# Altium schematic sheet Power Supply.SchDoc
size A4
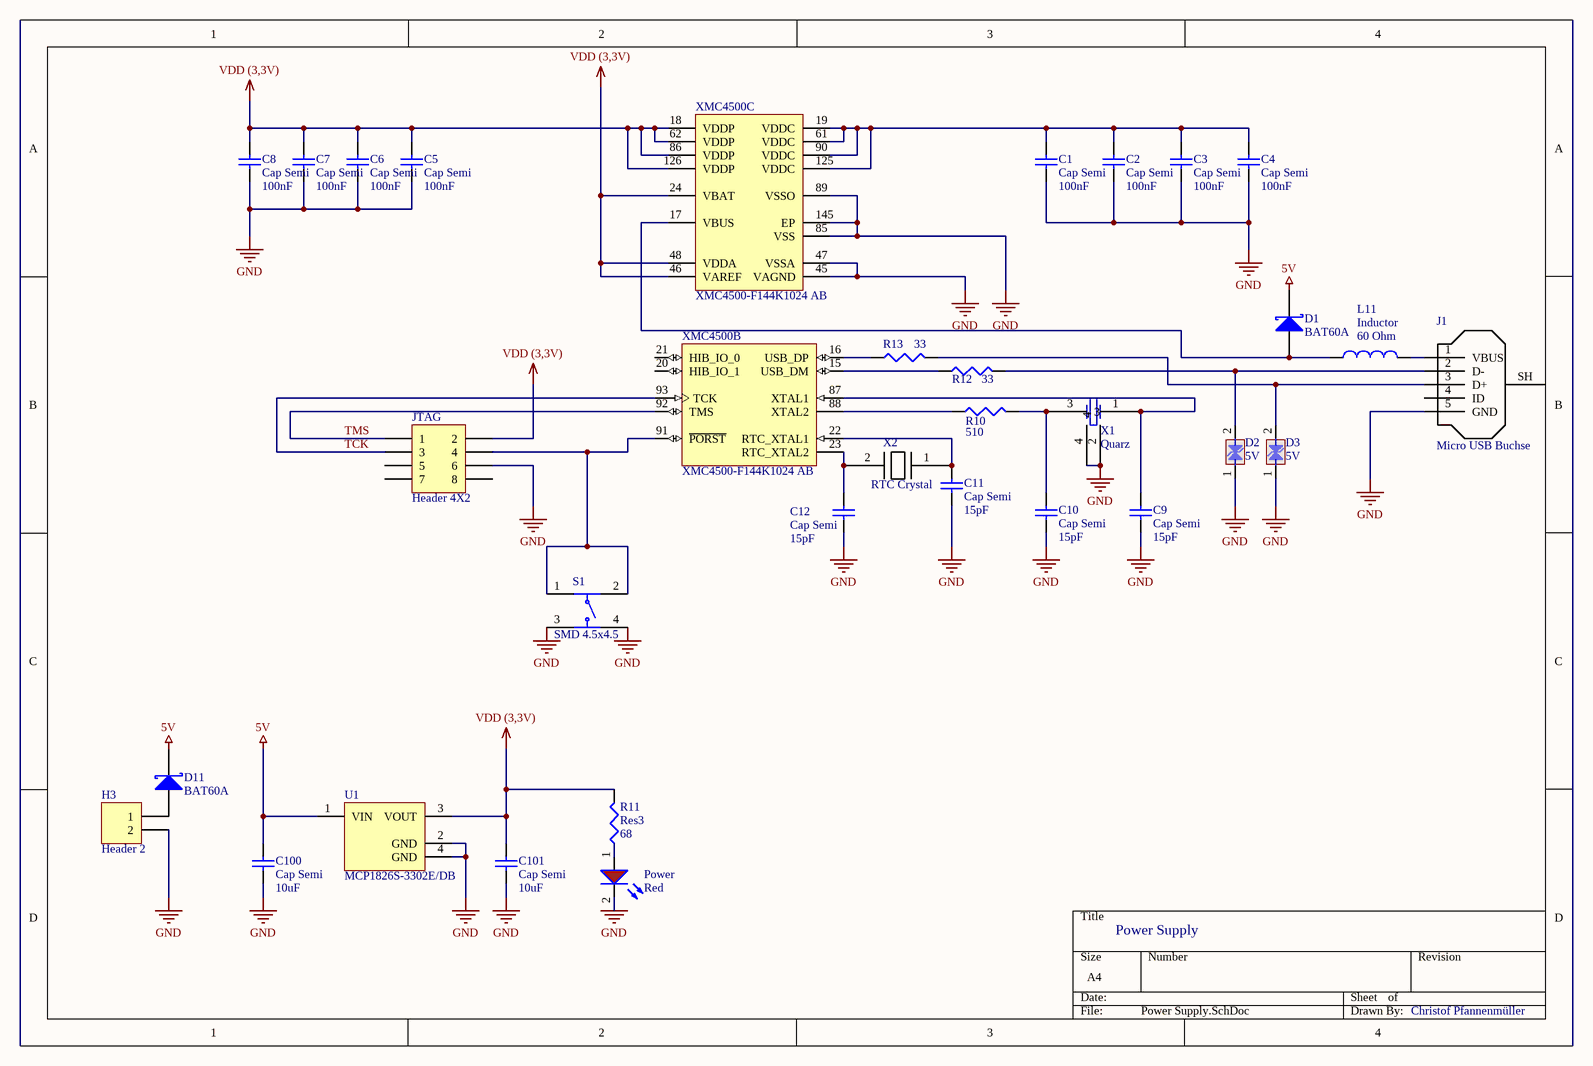
[diagram p0: Power Supply.SchDoc]

## Parts
C1  Cap Semi  value 100nF  [0402]
C2  Cap Semi  value 100nF  [0402]
C3  Cap Semi  value 100nF  [0402]
C4  Cap Semi  value 100nF  [0402]
C5  Cap Semi  value 100nF  [0402]
C6  Cap Semi  value 100nF  [0402]
C7  Cap Semi  value 100nF  [0402]
C8  Cap Semi  value 100nF  [0402]
C9  Cap Semi  value 15pF  [0402]
C10  Cap Semi  value 15pF  [0402]
C11  Cap Semi  value 15pF  [0402]
C12  Cap Semi  value 15pF  [0402]
C100  Cap Semi  value 10uF  [C1206]
C101  Cap Semi  value 10uF  [C1206]
D1  BAT60A  [SOD-323]
D2  5V  [WE-VE_0603]
D3  5V  [WE-VE_0603]
D11  BAT60A  [SOD-323]
H3  Header 2  [HDR1X2]
J1  Micro USB Buchse  [Micro USB Buchse - Molex]
JTAG  Header 4X2  [HDR2X4]
L11  Inductor  value 60 Ohm  [0603]
Power  Red  [LED_0805_Red]
R10  value 510  [J1-0603]  (hidden comment: Res3)
R11  Res3  value 68  [J1-0603]
R12  value 33  [J1-0603]  (hidden comment: Res3)
R13  value 33  [J1-0603]  (hidden comment: Res3)
S1  SMD 4.5x4.5  [430181038816]
U1  MCP1826S-3302E/DB  [SOT-223-DB3_N]
X1  Quarz  [Quarz]
X2  RTC Crystal  [RTC Uhrenquarz  1.5x3.2 SMD]
XMC4500  XMC4500-F144K1024 AB  [INF-PG-LQFP-144-18-6500X6500TP_N]  (parts B,C of 3)

## Nets
5V: C100.2 D1.1(K) D11.1(K) U1.1(VIN)
GND: C1.1 C2.1 C3.1 C4.1 C5.1 C6.1 C7.1 C8.1 C9.1 C10.1 C11.1 C12.1 C100.1 C101.1 D2.1(I/O1) D3.1(I/O1) H3.2 J1.5(GND) JTAG.6 Power.2(C) S1.3 S1.4 U1.2(GND) U1.4(GND) X1.2 X1.4 XMC4500.45(VAGND) XMC4500.47(VSSA) XMC4500.85(VSS) XMC4500.89(VSSO) XMC4500.145(EP)
VDD (3,3V): C5.2 C6.2 C7.2 C8.2 C101.2 JTAG.2 R11.2 U1.3(VOUT) XMC4500.18(VDDP) XMC4500.24(VBAT) XMC4500.46(VAREF) XMC4500.48(VDDA) XMC4500.62(VDDP) XMC4500.86(VDDP) XMC4500.126(VDDP)
TCK: JTAG.3 XMC4500.93(TCK)
TMS: JTAG.1 XMC4500.92(TMS)
NetC1_2: C1.2 C2.2 C3.2 C4.2 XMC4500.19(VDDC) XMC4500.61(VDDC) XMC4500.90(VDDC) XMC4500.125(VDDC)
NetC9_2: C9.2 X1.1 XMC4500.87(XTAL1)
NetC10_2: C10.2 R10.2 X1.3
NetC11_2: C11.2 X2.1 XMC4500.22(RTC_XTAL1)
NetC12_2: C12.2 X2.2 XMC4500.23(RTC_XTAL2)
NetD1_2: D1.2(A) L11.1 XMC4500.17(VBUS)
NetD2_2: D2.2(I/O2) J1.2(D-) R12.2
NetD3_2: D3.2(I/O2) J1.3(D+) R13.2
NetD11_2: D11.2(A) H3.1
NetJ1_1: J1.1(VBUS) L11.2
NetJTAG_4: JTAG.4 S1.1 S1.2 XMC4500.91(~{PORST})
NetPower_1: Power.1(A) R11.1
NetR10_1: R10.1 XMC4500.88(XTAL2)
NetR12_1: R12.1 XMC4500.15(USB_DM)
NetR13_1: R13.1 XMC4500.16(USB_DP)

Not connected (* = marked no-connect by the designer): J1 4(ID) SH; JTAG 5 7 8; XMC4500 20(HIB_IO_1) 21(HIB_IO_0)

## Notes on the sheet
- Power Supply
- Christof Pfannenmüller

## Library data of the parts
C1-C12 C100 C101 = Cap Semi: Capacitor (Semiconductor SIM Model); Published: 8-Jun-2000; LatestRevisionDate: 29-May-2009; LatestRevisionNote: IPC-7351 Footprint Added.; Publisher: Altium Limited; PackageDescription: Chip Capacitor
  C1-C12: PackageReference: C0402
  C100 C101: PackageReference: C1206
D1 D11 = BAT60A: Silicon AF Schottky Rectifier Diode with Extreme Low VF Drop; Published: 21-Mar-2003; LatestRevisionDate: 19-Mar-2004; LatestRevisionNote: Silkscreen size reduced.; DatasheetDocument: Jan-1999; PackageDocument: Sep-2000; PackageReference: SOD-323; Publisher: Altium Limited; ComponentLink1Description: Manufacturer Link; ComponentLink1URL: http://www.infineon.com/; ComponentLink2Description: Datasheet; ComponentLink2URL: http://www.infineon.com/upload/Document/cmc_upload/documents/081/715/bat60aseries_1.pdf
D2 D3 = WE-VE 0603, 82356050560: WE-VE ESD Suppressor, 0603, VDC=5V; Manufacturer: Wurth Elektronik; VDC: 5V; PartNo: 82356050560; ComponentLink1Description: Manufacturer; ComponentLink1URL: http://www.we-online.de; Created by: BJ.Chen; Created Date: Jan 2016; ComponentLink2Description: Datasheet; ComponentLink2URL: http://katalog.we-online.de/pbs/datasheet/82356050560.pdf
H3 = Header 2: Header, 2-Pin; LatestRevisionDate: 17-Jul-2002; LatestRevisionNote: Re-released for DXP Platform.; Publisher: Altium Limited
J1 = Micro USB Buchse - Molex
JTAG = Header 4X2: Header, 4-Pin, Dual row; LatestRevisionDate: 17-Jul-2002; LatestRevisionNote: Re-released for DXP Platform.; Publisher: Altium Limited
L11 = Inductor: Code_IEC: 1005; Published: 8-Jun-2000; LatestRevisionDate: 29-May-2009; LatestRevisionNote: IPC-7351 Footprint Added.; PackageReference: 0402-A; Publisher: Altium Limited; PackageDescription: Chip Inductor; Code_JEITA: 0402
Power = WL-SMCW 0805  150080RS75000: SMD mono-color Chip LED, WL-SMCW, Red; Manufacturer: W黵th Elektronik eiSos GmbH; PartNo: 150080RS75000; ComponentLink1Description: Manufacturer; ComponentLink1URL: http://www.we-online.de; Created by: Christin Otto; Created Date: June 2013; ComponentLink2Description: Datasheet; ComponentLink2URL: http://katalog.we-online.com/led/datasheet/150080RS75000.pdf; Color: Red
R10-R13 = Res3: Resistor; Published: 8-Jun-2000; LatestRevisionDate: 29-May-2009; LatestRevisionNote: IPC-7351 Footprint Added.; PackageReference: J1-0603; Publisher: Altium Limited; PackageDescription: Chip Resistor
S1 = WS-TASV, 430181038816: WS-TASV 4.5x4.5 mm SMD; Manufacturer: Wurth Elektronik; partNo: 430181038816; ComponentLink1Description: Manufacturer; ComponentLink1URL: http://www.we-online.de; Created by: Baojun Chen; Created Date: Dec.2015; ComponentLink2Description: Datasheet; ComponentLink2URL: http://katalog.we-online.de/em/datasheet/430181038816.pdf; Ausführung: SMD 4.5x4.5
U1 = MCP1826S-3302E/DB: 1000 mA, Low Voltage, Low Quiescent Current LDO Regulator, 3-Pin SOT-223, Extended Temperature; Manufacturer: Microchip; DatasheetVersion: revA, Aug-2007; PackageVersion: revBB, Aug-2009; PackageReference: SOT-223-DB3; PackageDescription: 3-Lead Plastic Small Outline Transistor (DB) [SOT-223]; Supplier 1: Digi-Key; Supplier Part Number 1: MCP1826S-3302E/DB-ND; Supplier 2: Newark; Supplier Part Number 2: 27M0037; Supplier 3: Mouser; Supplier Part Number 3: 579-MCP1826S-3302EDB; Mounting Technology: Surface Mount; PartNumber: MCP1826S-3302E/DB; ComponentLink1Description: Manufacturer URL; ComponentLink1URL: http://www.microchip.com/; ComponentLink2Description: Datasheet; ComponentLink2URL: http://ww1.microchip.com/downloads/en/DeviceDoc/22057a.pdf; ComponentLink3Description: Package Specification; ComponentLink3URL: http://www.microchip.com/stellent/groups/techpub_sg/documents/packagingspec/en012702.pdf
XMC4500 = XMC4500-F144K1024 AB: 120 MHz XMC4500 MCU with 1,024 KByte Program Memory, 160 KByte SRAM, 3.3 V, -40 to 125 degC, PG-LQFP-144, Green; Manufacturer: Infineon; A / D input lines (incl. FADC): 26; Digital I/O Lines: 91; Program Memory: 1,024.0 KByte; SRAM (incl. Cache): 160.0 KByte; Type of Serial I/O Interfaces: 6xSPI, Dual SPI, Quad SPI, UART, LIN, IIC, IIS; DatasheetVersion: V1.0; PackageVersion: V1.0; PackageReference: PG-LQFP-144-18; PackageDescription: 144-Pin Plastic (Green) Low Profile Quad Flat Package, 20 x 20 mm Body, 0.5 mm Pitch; Halogen-free: TRUE; Mounting Technology: Surface Mount; PartNumber: XMC4500-F144K1024 AB; ComponentLink1Description: Manufacturer URL; ComponentLink1URL: http://www.infineon.com; ComponentLink2Description: Datasheet; ComponentLink2URL: http://www.infineon.com/dgdl/xmc4500_ds_v1+0_2013_01.pdf?folderId=db3a30433580b3710135a47f3eb76c98&fileId=db3a304335b504400135bdca7ed86742&location=en.Products.Microcontrollers.32-bit_Industrial_Microcontrollers_based_on_ARM__Cortex_-M.32-bit_XMC4000_Industrial_Microcontrollers_ARM__Cortex_-M4.DATASHEET.xmc4500_ds_v1 0_2013_01.pdf; ComponentLink3Description: Package Specification; ComponentLink3URL: http://www.infineon.com/cms/packages/SMD_-_Surface_Mounted_Devices/P-PG-LQFP/P-PG-LQFP-144-04x_13x_14x_15x_16x_18.html?__locale=en